# Altium project UP02513040.PrjPcb
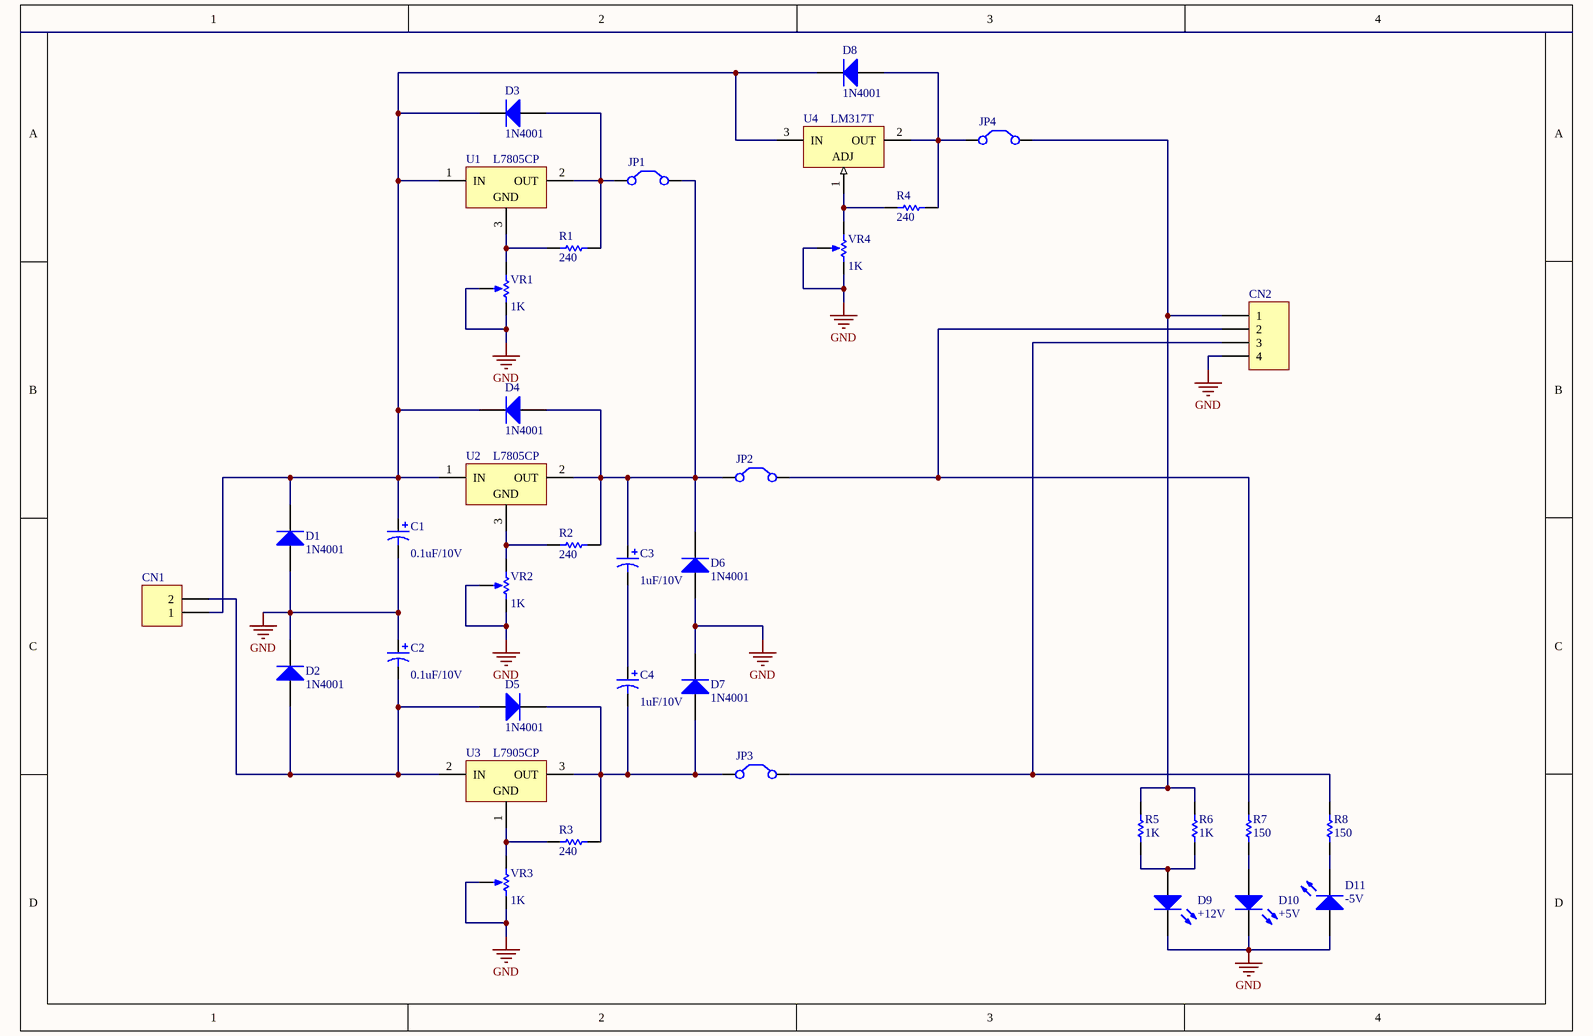
[diagram p0: UP02513040.SchDoc]
1 sheet, 37 parts. Net scope: global (net labels, ports and power ports of the same name join across sheets).
Board file: UP02513040.PcbDoc

## Sheet UP02513040.SchDoc: UP02513040 Power Supply Replacement
size A4; Engineer: Sacrifice; PageSetup: Record=PageOptions|CenterHorizontal=True|CenterVertical=True|PrintScale=0.34|XCorrection=1.00|YCorrection=1.00|PrintKind=0|BorderSize=5000000|LeftOffset=0|BottomOffset=0|Orientation=2|PaperLength=1000|PaperWidth=1000|Scale=100|PaperSource=15|PrintQuality=1200|MediaType=1|DitherType=10|PaperKind=A4|PrintScaleMode=1

### Parts
C1  value 0.1uF/10V  [RB7.6-15]  (hidden comment: Cap Pol1)
C2  value 0.1uF/10V  [RB7.6-15]  (hidden comment: Cap Pol1)
C3  value 1uF/10V  [RB7.6-15]  (hidden comment: Cap Pol1)
C4  value 1uF/10V  [RB7.6-15]  (hidden comment: Cap Pol1)
CN1  Header 2H  [HDR1X2H]  (value not drawn)
CN2  Header 4H  [HDR1X4H]  (value not drawn)
D1  1N4001  [DO-41]
D2  1N4001  [DO-41]
D3  1N4001  [DO-41]
D4  1N4001  [DO-41]
D5  1N4001  [DO-41]
D6  1N4001  [DO-41]
D7  1N4001  [DO-41]
D8  1N4001  [DO-41]
D9  +12V  [LED-0]
D10  +5V  [LED-0]
D11  -5V  [LED-0]
JP1  Jumper  [RAD-0.2]  (value not drawn)
JP2  Jumper  [RAD-0.2]  (value not drawn)
JP3  Jumper  [RAD-0.2]  (value not drawn)
JP4  Jumper  [RAD-0.2]  (value not drawn)
R1  value 240  [AXIAL-0.3]  (hidden comment: Res1)
R2  value 240  [AXIAL-0.3]  (hidden comment: Res1)
R3  value 240  [AXIAL-0.3]  (hidden comment: Res1)
R4  value 240  [AXIAL-0.3]  (hidden comment: Res1)
R5  value 1K  [AXIAL-0.3]  (hidden comment: Res1)
R6  value 1K  [AXIAL-0.3]  (hidden comment: Res1)
R7  value 150  [AXIAL-0.3]  (hidden comment: Res1)
R8  value 150  [AXIAL-0.3]  (hidden comment: Res1)
U1  L7805CP  [ISOWATT220AB]
U2  L7805CP  [ISOWATT220AB]
U3  L7905CP  [ISOWATT220AB]
U4  LM317T  [221A-04]
VR1  value 1K  [VR5]  (hidden comment: RPot)
VR2  value 1K  [VR5]  (hidden comment: RPot)
VR3  value 1K  [VR5]  (hidden comment: RPot)
VR4  value 1K  [VR5]  (hidden comment: RPot)

### Nets
GND: C1.2 C2.1 CN2.4 D1.1(A) D2.2(K) D6.1(A) D7.2(K) D9.2(K) D10.2(K) D11.1(A) VR1.2(BOT) VR1.3(TAP) VR2.2(BOT) VR2.3(TAP) VR3.2(BOT) VR3.3(TAP) VR4.2(BOT) VR4.3(TAP)
NetC1_1: C1.1 CN1.1 D1.2(K) D3.2(K) D4.2(K) D8.2(K) U1.1(IN) U2.1(IN) U4.3(IN)
NetC2_2: C2.2 CN1.2 D2.1(A) D5.1(A) U3.2(IN)
NetC3_1: C3.1 D4.1(A) D6.2(K) JP1.2(C2) JP2.1(C1) R2.1 U2.2(OUT)
NetC3_2: C3.2 C4.1
NetC4_2: C4.2 D5.2(K) D7.1(A) JP3.1(C1) R3.1 U3.3(OUT)
NetCN2_1: CN2.1 JP4.2(C2) R5.1 R6.1
NetCN2_2: CN2.2 JP2.2(C2) R7.1
NetCN2_3: CN2.3 JP3.2(C2) R8.1
NetD3_1: D3.1(A) JP1.1(C1) R1.1 U1.2(OUT)
NetD8_1: D8.1(A) JP4.1(C1) R4.1 U4.2(OUT)
NetD9_1: D9.1(A) R5.2 R6.2
NetD10_1: D10.1(A) R7.2
NetD11_2: D11.2(K) R8.2
NetR1_2: R1.2 U1.3(GND) VR1.1(TOP)
NetR2_2: R2.2 U2.3(GND) VR2.1(TOP)
NetR3_2: R3.2 U3.1(GND) VR3.1(TOP)
NetR4_2: R4.2 U4.1(ADJ) VR4.1(TOP)

### Library data of the parts
C1-C4 = Cap Pol1: Polarized Capacitor (Radial); Published: 8-Jun-2000; LatestRevisionDate: 17-Jul-2002; LatestRevisionNote: Re-released for DXP Platform.; PackageReference: RB7.6-15; Publisher: Altium Limited; PackageDescription: Polarized Capacitor (Radial); 2 Leads
CN1 = Header 2H: Header, 2-Pin, Right Angle; Manufacturer: PHOENIX CONTACT; Manufacturer Part Number: 1725656; Pitch Spacing: 2.54; No. of Positions: 2; Wire Size AWG Min: 26; Wire Size AWG Max: 20; Conductor Area CSA: 0.5; Wire Connection Method: Screw; Rated Current: 6; Rated Voltage: 125; Block Orientation: Through Hole Right Angle; Product Range: MPT; SVHC: No SVHC (15-Jun-2015); Connector Mounting: PCB Mount; Connector Type: Terminal Block, PCB; Voltage Rating VAC: 63; Wire Area Size Min: 0.14mm²<!--FANDB--><div class="features-and-benefits-container"><div class="features-and-benefits-description"><span class="features-benefits-value">The 1725656 is a 2-way Wire-to-board PCB Terminal Block made of PA insulation that allows connection of two conductors. The MPT 0,5/ 2-2,54 has extremely small design for the respective conductor cross section. It features screw connection with tension sleeve and wave soldering.</span></div><div class="features-and-benefits-list"><ul class="features-and-benefits-list-list"><li class="features-and-benefits-list-item">Green color</li><li class="features-and-benefits-list-item">Well-known connection principle allows worldwide use</li><li class="features-and-benefits-list-item">UL94V-0 Flammability rating</li><li class="features-and-benefits-list-item">Low temperature rise, maximum contact force</li></ul></div><div class="features-and-benefits-applications"><ul class="features-and-benefits-value"><li class="features-and-benefits-list-item">Industrial</li></ul></div></div>; LatestRevisionDate: 17-Jul-2002; LatestRevisionNote: Re-released for DXP Platform.; Publisher: Altium Limited; RoHS: YES; Wire Area Size Max: 0.5; ComponentLink1URL: http://eshop.phoenixcontact.com/phoenix/treeViewClick.do?UID=1725656&parentUID=null&reloadFrame=true; ComponentLink1Description: http://eshop.phoenixcontact.com/phoenix/treeViewClick.do?UID=1725656&parentUID=null&reloadFrame=true; ComponentLink2URL: http://www.farnell.com/datasheets/2309717.pdf; ComponentLink2Description: http://www.farnell.com/datasheets/2309717.pdf; ComponentLink3URL: http://www.farnell.com/product360s/PHOENIXCONTACT-2WAY.php; ComponentLink3Description: http://www.farnell.com/product360s/PHOENIXCONTACT-2WAY.php; ComponentLink4URL: http://www.farnell.com/product360s/product360.php?productshortname=PHOENIXCONTACT-2WAY; ComponentLink4Description: http://www.farnell.com/product360s/product360.php?productshortname=PHOENIXCONTACT-2WAY; Supplier 1: Farnell; Supplier Part Number 1: 2785623; Stock 1: 15; Pricing 1: 1=7.29 (GBP); ComponentLink5URL: http://www.farnell.com/datasheets/1378966.pdf; ComponentLink5Description: http://www.farnell.com/datasheets/1378966.pdf; ComponentLink6URL: http://www.farnell.com/datasheets/2369305.pdf; ComponentLink6Description: http://www.farnell.com/datasheets/2369305.pdf
CN2 = Header 4H: Header, 4-Pin, Right Angle; LatestRevisionDate: 17-Jul-2002; LatestRevisionNote: Re-released for DXP Platform.; Publisher: Altium Limited; Supplier 1: Farnell; Supplier Part Number 1: 2785762
D1-D8 = Diode 1N4001: 1 Amp General Purpose Rectifier; Manufacturer: Micro Commercial Co; Manufacturer Part Number: 1N4001-TP; Diode Type: Standard; Current - Average Rectified (Io): 1A; Voltage - Forward (Vf) (Max) @ If: 1.1V @ 1A; Speed: Standard Recovery >500ns, > 200mA (Io); Current - Reverse Leakage @ Vr: 5µA @ 50V; Published: 8-Jun-2000; LatestRevisionDate: 17-Jul-2002; LatestRevisionNote: Re-released for DXP Platform.; DatasheetVersion: 1998; PackageVersion: Aug-1999; PackageReference: DO-41; Publisher: Altium Limited; PackageDescription: Diode, Axial; Body 5.2 x 2.7 mm (LxDia. max), Lead Dia. 0.86 mm (max); Code_JEDEC: DO-204-AL; ComponentLink1Description: Manufacturer Link; ComponentLink1URL: http://www.fairchildsemi.com/; ComponentLink2Description: Datasheet; ComponentLink2URL: http://www.fairchildsemi.com/ds/1N%2F1N4001.pdf; Supplier 1: Digi-Key; Supplier Part Number 1: 1N4001-TPMSTR-ND; RoHS: RoHS Compliant; Category: Discrete Semiconductor Products; Stock 1: 80000; Pricing 1: 5000=0.01415, 10000=0.0123, 25000=0.01107, 50000=0.00984, 125000=0.0082 (EUR); Packaging: Tape & Reel (TR); Part Status: Active; Capacitance @ Vr, F: -; Mounting Type: Through Hole; Package / Case: DO-204AL, DO-41, Axial; Supplier Device Package: DO-41; Operating Temperature - Junction: -55°C ~ 150°C; ComponentLink3URL: http://www.mccsemi.com/up_pdf/1N4001-1N4007(DO-41).pdf; ComponentLink3Description: http://www.mccsemi.com/up_pdf/1N4001-1N4007(DO-41).pdf
D9-D11 = LED0: Typical INFRARED GaAs LED; Manufacturer: MULTICOMP; Published: 8-Jun-2000; LatestRevisionDate: 08-Jul-2005; LatestRevisionNote: Mech Layer 1 removed.; PackageReference: LED-0; Publisher: Altium Limited; PackageDescription: LED; 2 Leads; Supplier 1: Newark; Supplier Part Number 1: 15R2196; Manufacturer Part Number: OVL-3324; RoHS: YES; Stock 1: 1580; Pricing 1: 1=0.576, 10=0.432, 100=0.287, 200=0.222, 500=0.18, 1000=0.14, 2000=0.13, 5000=0.123 (USD); ComponentLink1URL: http://www.farnell.com/datasheets/1661953.pdf; ComponentLink1Description: http://www.farnell.com/datasheets/1661953.pdf
JP1-JP4 = Jumper: Jumper Wire; Manufacturer: MULTICOMP; Manufacturer Part Number: 2211S-02G; Pitch Spacing: 2.54; No. of Contacts: 2; Gender: Header; Product Range: 2211; Contact Termination Type: Through Hole; No. of Rows: 1; Contact Resistance: 20; Contact Termination: Solder; Current Rating: 3; Insulation Resistance: 1000; Voltage Rating VAC: 250; Withstand Voltage: 600V<!--FANDB--><div class="features-and-benefits-container"><div class="features-and-benefits-description"><span class="features-benefits-value">The 2211S series from Multicomp are 2.54mm pitch, single row PCB headers.</span></div><div class="features-and-benefits-list"><ul class="features-and-benefits-list-list"><li class="features-and-benefits-list-item">Vertical mounting</li><li class="features-and-benefits-list-item">Current rating of 3A</li><li class="features-and-benefits-list-item">Voltage rating of 250VAC/DC</li><li class="features-and-benefits-list-item">Operating temperature range -40°C to 105°C</li><li class="features-and-benefits-list-item">Contact material is copper alloy</li><li class="features-and-benefits-list-item">Gold plated contacts</li><li class="features-and-benefits-list-item">Number of contacts varies from 2 to 24 pins</li><li class="features-and-benefits-list-item">Maximum contact resistance of 20mohm</li><li class="features-and-benefits-list-item">Minimum insulation resistance of 1000; Published: 24-Mar-1999; LatestRevisionDate: 17-Jul-2002; LatestRevisionNote: Re-released for DXP Platform.; PackageReference: RAD-0.2; Publisher: Altium Limited; PackageDescription: Radial Cap, Thru-Hole; 2 Leads; 0.2 in Pin Spacing; Supplier 1: Farnell; Supplier Part Number 1: 1593411; RoHS: YES; Stock 1: 245370; Pricing 1: 1=0.0204, 500=0.018, 1500=0.0153, 2500=0.0133, 5000=0.0102, 10000=0.0068 (GBP); Contact Plating: Gold Plated Contacts; Contact Material: Copper Alloy; Colour: Black; Flammability Rating: UL94V-0; Lead Spacing: 2.54; Operating Temperature Max: 105; Operating Temperature Min: -40; Termination Method: Solder; ComponentLink1URL: http://www.farnell.com/datasheets/1518407.pdf; ComponentLink1Description: http://www.farnell.com/datasheets/1518407.pdf
R1-R8 = Res1: Resistor; Manufacturer: NTE Electronics, Inc.; Manufacturer Part Number: EW124; Published: 8-Jun-2000; LatestRevisionDate: 17-Jul-2002; LatestRevisionNote: Re-released for DXP Platform.; PackageReference: AXIAL-0.3; Publisher: Altium Limited; PackageDescription: Axial Device, Thru-Hole; 2 Leads; 0.3 in Pin Spacing; Supplier 1: Allied; RoHS: No; ComponentLink1URL: https://www.alliedelec.com/m/d/9b79b2702712920db6f5ed7725f174c1.pdf; ComponentLink1Description: https://www.alliedelec.com/m/d/9b79b2702712920db6f5ed7725f174c1.pdf; ComponentLink2URL: https://www.alliedelec.com/nte-electronics-inc-ew124/70723335/; ComponentLink2Description: https://www.alliedelec.com/nte-electronics-inc-ew124/70723335/
  R1-R4: Supplier Part Number 1: 70723335; Stock 1: 0; Pricing 1: 1=0.0900 (USD)
  R5 R6: Supplier Part Number 1: 70723350
  R7 R8: Supplier Part Number 1: 70723330
U1 U2 = L7805CP: Positive Voltage Regulator; Manufacturer: STMicroelectronics; Note: Tab is connected to pin 3 (GND).; Output Voltage: 5V; Max Input Voltage: 35V; Number of Outputs: 1; Max Output Current: 1.5A; Quiescent Current: 8mA; Min Input Voltage: 7V; Dropout Voltage: 2V; Min Output Voltage: 4.65V; Tolerance: 5%; Power Supply Rejection Ratio (PSRR): 62dB; Published: 24-Aug-2001; LatestRevisionDate: 17-Jul-2002; LatestRevisionNote: Re-released for DXP Platform.; DatasheetVersion: Dec-1998; PackageVersion: Jul-1998; PackageReference: ISOWATT220AB; Publisher: Altium Limited; PackageDescription: TO, Thru-Hole, Vertical, Heatsink Mounted; 3 In-Line Leads; Pitch 2.54 mm; Pin sequence 1, 3, 2; ComponentLink1Description: Manufacturer Link; ComponentLink1URL: http://www.st.com/; Supplier 1: RSComponents; Supplier Part Number 1: 296756; Manufacturer Part Number: L7805CP; Stock 1: 1072; Pricing 1: 1=0.64, 10=0.55, 50=0.45, 100=0.36, 250=0.33 (EUR); Mount: Through Hole; Case/Package: TO-220-3; Number of Pins: 3; Weight: 0.08113oz; Min Operating Temperature: 0°C; Max Operating Temperature: 125°C; Polarity: Positive; Output Current: 1.5A; Packaging: Rail/Tube; Package Quantity: 50; Nominal Output Voltage: 5V; Number of Regulators: 1; Length: 10.4mm; Height: 9.3mm; Width: 4.6mm; Radiation Hardening: No; REACH SVHC: No SVHC; Lead Free: Lead Free; ComponentLink2URL: https://datasheet.ciiva.com/14149/l78xx-c-ab-ac-eng-tds-14149769.pdf; ComponentLink2Description: https://datasheet.ciiva.com/14149/l78xx-c-ab-ac-eng-tds-14149769.pdf; ComponentLink3URL: https://datasheet.ciiva.com/3224/cd00000444-3224937.pdf; ComponentLink3Description: https://datasheet.ciiva.com/3224/cd00000444-3224937.pdf; ComponentLink4URL: https://datasheet.ciiva.com/2044/cd00000444-2044511.pdf; ComponentLink4Description: https://datasheet.ciiva.com/2044/cd00000444-2044511.pdf; ComponentLink5URL: https://datasheet.ciiva.com/16382/cd00000444-16382022.pdf; ComponentLink5Description: https://datasheet.ciiva.com/16382/cd00000444-16382022.pdf; ComponentLink6URL: https://datasheet.ciiva.com/1511/1805459-1511911.pdf; ComponentLink6Description: https://datasheet.ciiva.com/1511/1805459-1511911.pdf; ComponentLink7URL: https://datasheet.ciiva.com/1511/1805459-1511912.pdf; ComponentLink7Description: https://datasheet.ciiva.com/1511/1805459-1511912.pdf
U3 = L7905CP: Negative Voltage Regulator; Manufacturer: STMicroelectronics; Note: Tab is connected to pin 3 (IN).; Output Type: Fixed; Voltage - Input (Max): -35V; Voltage - Output (Min/Fixed): -5V; Voltage Dropout (Max): 1.4V @ 1A (Typ); Current - Output: 1.5A; PSRR: 60dB (120Hz); Protection Features: Over Temperature, Short Circuit; Published: 24-Aug-2001; LatestRevisionDate: 17-Jul-2002; LatestRevisionNote: Re-released for DXP Platform.; DatasheetVersion: Apr-1997; PackageVersion: Jul-1998; PackageReference: ISOWATT220AB; Publisher: Altium Limited; PackageDescription: TO, Thru-Hole, Vertical, Heatsink Mounted; 3 In-Line Leads; Pitch 2.54 mm; Pin sequence 1, 3, 2; ComponentLink1Description: Manufacturer Link; ComponentLink1URL: http://www.st.com/; ComponentLink2Description: Datasheet; ComponentLink2URL: http://www.st.com/stonline/products/literature/ds/2149/l7905c.pdf; Supplier 1: Digi-Key; Supplier Part Number 1: 497-7293-5-ND; Manufacturer Part Number: L7905CP; RoHS: RoHS Compliant; Category: Integrated Circuits (ICs); Stock 1: 3343; Pricing 1: 1=0.72, 10=0.642, 100=0.5005, 500=0.41348, 1000=0.32643 (EUR); Packaging: Tube; Part Status: Active; Output Configuration: Negative; Voltage - Output (Max): -; Control Features: -; Operating Temperature: 0°C ~ 125°C; Mounting Type: Through Hole; Package / Case: TO-220-3 Full Pack; Supplier Device Package: TO-220FP; ComponentLink3URL: http://media.digikey.com/pdf/Data%20Sheets/ST%20Microelectronics%20PDFS/L79xxC_Rev21_May2012.pdf; ComponentLink3Description: http://media.digikey.com/pdf/Data%20Sheets/ST%20Microelectronics%20PDFS/L79xxC_Rev21_May2012.pdf
U4 = LM317T: 3-Terminal Adjustable Positive Voltage Regulator; Note: Heatsink surface connected to pin 2.; Published: 17-Jul-2002; DatasheetVersion: 1988; PackageReference: 221A-04; Publisher: Altium Limited; PackageDescription: TO, Thru-Hole, Vertical, Heatsink Mounted; 3 In-Line Leads; Pitch 2.54 mm; Code_JEDEC: TO-262-AA; ComponentLink1Description: Manufacturer Link; ComponentLink1URL: http://www.onsemi.com/site/products/taxonomy/0,4438,503,00.html; ComponentLink2Description: Datasheet; ComponentLink2URL: http://www.onsemi.com/pub/Collateral/LM317-D.PDF; Supplier 1: Farnell; Supplier Part Number 1: 1652293
VR1-VR4 = RPot: Potentiometer; Manufacturer: BOURNS; Manufacturer Part Number: 3266W-1-103LF; Sim Note: Enter the Resistance value and the set point into parameter fields.; Set Position: 0.5; Track Resistance: 10; Power Rating: 250; Resistance Tolerance: ± 10%; Product Range: Trimpot 3266 Series; No. of Turns: 12; Potentiometer Mounting: Through Hole; Temperature Coefficient: ± 100; SVHC: No SVHC (20-Jun-2016)<!--FANDB--><div class="features-and-benefits-container"><div class="features-and-benefits-description"><span class="features-benefits-value">The Trimpot 3266 series from Bourns are cermet, through hole trimming potentiometers. These potentiometers are multiturn which performs a variety of circuit adjustments in all types of electronic equipment. Typical applications are measuring linear distance, angle or rotation in production equipments.</span></div><div class="features-and-benefits-list"><ul class="features-and-benefits-list-list"><li class="features-and-benefits-list-item">1/4inch square potentiometer</li><li class="features-and-benefits-list-item">Side or top adjustment with lead screw</li><li class="features-and-benefits-list-item">Sealing is IP65 rated</li><li class="features-and-benefits-list-item">12 turns and rotational life of 200 cycles</li><li class="features-and-benefits-list-item">Resistance value ranges from 10 ohm to 1Mohm</li><li class="features-and-benefits-list-item">±10% tolerance</li><li class="features-and-benefits-list-item">Temperature coefficient is ±100ppm/°C</li><li class="features-and-benefits-list-item">Operating temperature ranges from -55°C to +125°C</li><li class="features-and-benefits-list-item">Power rating is 0.25; Published: 8-Jun-2000; LatestRevisionDate: 17-Jul-2002; LatestRevisionNote: Re-released for DXP Platform.; PackageReference: VR5; Publisher: Altium Limited; PackageDescription: Variable Resistor, Thru-Hole; 3 Leads; Supplier 1: Farnell; Supplier Part Number 1: 9352651; RoHS: YES; Stock 1: 4555; Pricing 1: 1=3.16, 5=2.81, 10=2.46, 25=2.25, 50=1.97, 200=1.58, 1000=1.43, 2000=1.34 (GBP); Automotive Qualification Standard: -; MSL: -; ComponentLink1URL: http://www.bourns.com/engineering/3266/3266W.stp; ComponentLink1Description: http://www.bourns.com/engineering/3266/3266W.stp; ComponentLink2URL: http://www.farnell.com/datasheets/2061259.pdf; ComponentLink2Description: http://www.farnell.com/datasheets/2061259.pdf; ComponentLink3URL: http://www.farnell.com/cad/1563549.stp; ComponentLink3Description: http://www.farnell.com/cad/1563549.stp